# Altium schematic sheet STM32_microcontroller_power.SchDoc: STM32_microcontroller_power
size A4; Date: Not used; ApprovedBy: Not used; CheckedBy: Not used; Author: Not used; CompanyName: STMicroelectronics; DrawnBy: Not used; Engineer: Not used; Organization: Not used; Address1: Not used; Address2: Not used; Address3: Not used; Address4: Not used; DocumentNumber: Not used; Revision: Not used; SheetNumber: 4; SheetTotal: 12; CurrentTime: Not used; CurrentDate: Not used; Time: Not used; DocumentFullPathAndName: Not used; DocumentName: Not used; ModifiedDate: Not used; ImagePath: Not used; ProjectName: Not used; Application_BuildNumber: Not used
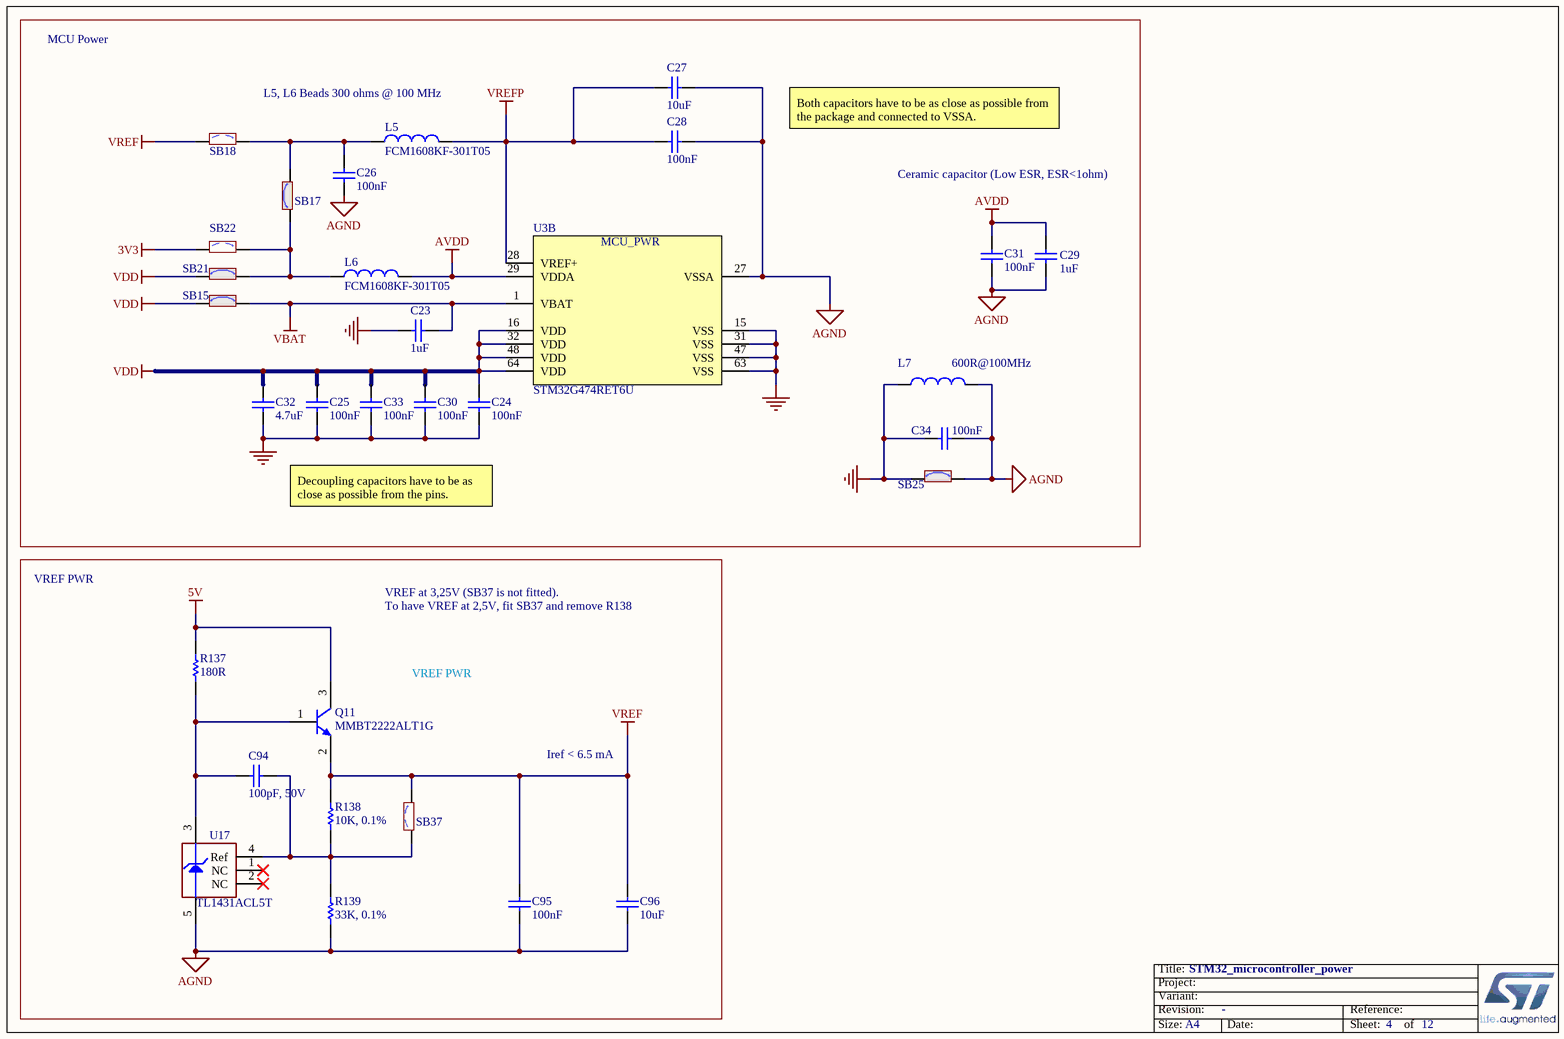
[diagram p0: STM32_microcontroller_power.SchDoc]

## Parts
C23  value 1uF  [C0603]
C24  value 100nF  [C0402]
C25  value 100nF  [C0402]
C26  value 100nF  [C0402]
C27  value 10uF  [C0603]
C28  value 100nF  [C0402]
C29  value 1uF  [C0603]
C30  value 100nF  [C0402]
C31  value 100nF  [C0402]
C32  value 4.7uF  [C0603]
C33  value 100nF  [C0402]
C34  value 100nF  [C0402]
C94  value 100pF, 50V  [C0603_H0P8]
C95  value 100nF  [C0603]
C96  value 10uF  [C0603]
L5  value FCM1608KF-301T05  [L0603]  (hidden comment: BEAD)
L6  value FCM1608KF-301T05  [L0603]  (hidden comment: BEAD)
L7  value 600R@100MHz  [L0603]
Q11  value MMBT2222ALT1G  [NPN_SOT23]  (hidden comment: 9013-SOT23)
R137  value 180R  [R0603]
R138  value 10K, 0.1%  [R0603]
R139  value 33K, 0.1%  [R0603]
SB15  (no value)  [SOLDER-BRIDGE_R0603-0R]
SB17  (no value)  [SOLDER-BRIDGE_R0603-0R]
SB18  (no value)  [SOLDER-BRIDGE_R0603-0R]
SB21  (no value)  [SOLDER-BRIDGE_R0603-0R]
SB22  (no value)  [SOLDER-BRIDGE_R0603-0R]
SB25  (no value)  [SOLDER-BRIDGE_R0603-0R]
SB37  (no value)  [SOLDER-BRIDGE_R0603-0R]
U3  STM32G474RET6U  [ICC_LQFP64_10X10_P050]  (part B of 2)
U17  value TL1431ACL5T  [ICC_SOT23-5L_H1P45]

## Nets
3V3: SB22.1
5V: Q11.3(C) R137.2
AGND: C26.1 C27.1 C28.2 C29.1 C31.1 C34.2 C95.1 C96.1 L7.2 R139.1 SB25.2 U3.27(VSSA) U17.5(Anode)
AVDD: C29.2 C31.2 L6.2 U3.29(VDDA)
GND: C23.1 C24.1 C25.1 C30.1 C32.1 C33.1 C34.1 L7.1 SB25.1 U3.15(VSS) U3.31(VSS) U3.47(VSS) U3.63(VSS)
VBAT: C23.2 SB15.2 U3.1(VBAT)
VDD: C24.2 C25.2 C30.2 C32.2 C33.2 SB15.1 SB21.1 U3.16(VDD) U3.32(VDD) U3.48(VDD) U3.64(VDD)
VREF: C95.2 C96.2 Q11.2(E) R138.2 SB18.1 SB37.2
VREFP: C27.2 C28.1 L5.2 U3.28(VREF+)
NetC26_2: C26.2 L5.1 SB17.2 SB18.2
NetC94_1: C94.1 Q11.1(B) R137.1 U17.3(Cathode)
NetC94_2: C94.2 R138.1 R139.2 SB37.1 U17.4(Ref)
NetL6_1: L6.1 SB17.1 SB21.2 SB22.2

Not connected (* = marked no-connect by the designer): U17 1(NC)* 2(NC)*

## Notes on the sheet
- MCU Power
- L5, L6 Beads 300 ohms @ 100 MHz
- Both capacitors have to be as close as possible from the package and connected to VSSA.
- Ceramic capacitor (Low ESR, ESR<1ohm)
- Decoupling capacitors have to be as close as possible from the pins.
- VREF PWR
- VREF at 3,25V (SB37 is not fitted).
- To have VREF at 2,5V, fit SB37 and remove R138
- Iref < 6.5 mA
- Title:
- Project:
- Size:
- Revision:
- Variant:
- A4
- -
- Date:
- Reference:
- Sheet:
- of
- (in symbol MCD-01584, part B) MCU_PWR

## Library data of the parts
C23 C29 = MCD-00010: Capacitor, MLCC, 1uF, 16V, X5R, 10%, 0603, T=0,8mm; Manufacturer_Part_Number: CC0603KRX5R7BB105; Manufacturer: YAGEO; Provided_By: SUBCO; Internal_Part_Number: MCD-00010; Status: Released; Package: C0603; ComponentLink1Description: Datasheet; Part_Type: Capacitor; ComponentLink1URL: http://tunmcdsvn.tun.st.com/Component_Datasheet_Library/Trunk/Capacitors/Yageo_Multilayer_capacitor_X5R_series_100pF_to_100uF
C24-C26 C28 C30 C31 C33 C34 = MCD-00102: Capacitor, MLCC, 100nF, 16V, X7R, 10%, 0402, T=0,5mm; Manufacturer_Part_Number: CC0402KRX7R7BB104; Manufacturer: YAGEO; Alternate_Manufacturer_Part_Number: GCM155R71C104KA55D; Alternate_Manufacturer: MURATA; Provided_By: SUBCO; Internal_Part_Number: MCD-00102; Status: Released; Package: C0402; ComponentLink1Description: Datasheet; Part_Type: Capacitor; ComponentLink1URL: http://tunmcdsvn.tun.st.com/Component_Datasheet_Library/Trunk/Capacitors/Yageo_Multilayer_Capacitor_X7R_series_100pF_to_22uF
C27 C96 = MCD-01124: Capacitor, MLCC, 10µF, 10V, X5R, 10%, 0603, T=0.8mm; Manufacturer_Part_Number: GRM188R61A106KAAL; Manufacturer: MURATA; Provided_By: SUBCO; Internal_Part_Number: MCD-01124; Status: Released; Part_Type: Capacitor; Package: C0603; ComponentLink1Description: Datasheet; ComponentLink1URL: http://tunmcdsvn.tun.st.com/Component_Datasheet_Library/Trunk/Capacitors/Murata_Capacitor_GR_series
C32 = MCD-00009: Capacitor, MLCC, 4.7uF, 16V, X5R, 10%, 0603, T=0.8mm; Manufacturer_Part_Number: CC0603KRX5R7BB475; Manufacturer: YAGEO; Provided_By: SUBCO; Internal_Part_Number: MCD-00009; ComponentLink1Description: Datasheet; Status: Released; Part_Type: Capacitor; Package: C0603; ComponentLink1URL: http://tunmcdsvn.tun.st.com/Component_Datasheet_Library/Trunk/Capacitors/Yageo_Multilayer_capacitor_X5R_series_100pF_to_100uF
C94 = MCD-01648: Capacitor, MLCC, 100pF, 50V, NPO, 5%, 0603, T=0,8mm; Manufacturer_Part_Number: CC0603JRNPO9BN101; Manufacturer: YAGEO; Provided_By: SUBCO; Internal_Part_Number: MCD-01648; Status: Footprint available; Part_Type: Capacitor; Package: C0603; ComponentLink1Description: Datasheet; ComponentLink1URL: http://tunmcdsvn.tun.st.com/Component_Datasheet_Library/Trunk/Capacitors/Yageo_UPY-GP_NP0_16V-to-50V/YAGEO_NP0_UPY-GP_NP0_16V-to-50V_16.pdf
C95 = MCD-00211: Capacitor, MLCC, 100nF, 16V, X7R, 10%, 0603, T=0,8mm; Manufacturer_Part_Number: CC0603KRX7R7BB104; Manufacturer: YAGEO; Provided_By: SUBCO; Internal_Part_Number: MCD-00211; Status: Released; Part_Type: Capacitor; Package: C0603; ComponentLink1Description: Datasheet; ComponentLink1URL: http://tunmcdsvn.tun.st.com/Component_Datasheet_Library/Trunk/Capacitors/Yageo_Multilayer_Capacitor_X7R_series_100pF_to_22uF
L5 L6 = MCD-01735: Bead,300R,500mA,0603; Part_Type: Inductor; Manufacturer: TAI-TECH; Provided_By: SUBCO; Internal_Part_Number: MCD-01735; Status: Footprint available; Manufacturer_Part_Number: FCM1608KF-301T05; Package: L0603; ComponentLink1Description: Datasheet; ComponentLink1URL: http://tunmcdsvn.tun.st.com/Component_Datasheet_Library/Trunk/Inductors/TaiTech_Bead_FCM1608_series
L7 = MCD-00047: SMD Chip ferrite bead, 600R@100MHz +/-25%, 350mA, 500mohm DC, 0603, T=0.8mm; Part_Type: Inductor; Manufacturer_Part_Number: FCM1608KF-601T03; Manufacturer: TAI-TECH; Provided_By: SUBCO; Internal_Part_Number: MCD-00047; Status: Released; ComponentLink1Description: Datasheet; ComponentLink1URL: http://tunmcdsvn.tun.st.com/Component_Datasheet_Library/Trunk/Inductors/TaiTech_Bead_FCM1608_series
Q11 = MCD-01737: NPN Bipolar Transistor; Part_Type: IC; Manufacturer: ON SEMICONDUCTOR; Provided_By: SUBCO; Revision: *; Internal_Part_Number: MCD-01737; Status: Footprint available; Manufacturer_Part_Number: MMBT2222ALT1G; ComponentLink1Description: Datasheet; ComponentLink1URL: http://tunmcdsvn.tun.st.com/Component_Datasheet_Library/Trunk/IC/ON_SEMICONDUCTOR_Transistor_MMBT2222ALT1G/ON_SEMICONDUCTOR_Transistor_MMBT2222ALT1G.pdf
R137 = MCD-00342: Resistor,180R,0603,1%,1/10W; Manufacturer_Part_Number: RC0603FR-07180RL; Manufacturer: YAGEO; Provided_By: SUBCO; Internal_Part_Number: MCD-00342; Status: Released; Part_Type: Resistor; Package: R0603; ComponentLink1Description: Datasheet; ComponentLink1URL: http://tunmcdsvn.tun.st.com/Component_Datasheet_Library/Trunk/Resistors/Yageo_Resistor_RC0603-series
R138 = MCD-01669: Resistor, 10K, 0603, 0.1%,1/10W; Manufacturer_Part_Number: ERA3AEB103V; Manufacturer: PANASONIC; Provided_By: SUBCO; Internal_Part_Number: MCD-01669; Status: Footprint available; Part_Type: Resistor; Package: R0603; ComponentLink1Description: Datasheet; ComponentLink1URL: http://tunmcdsvn.tun.st.com/Component_Datasheet_Library/Trunk/Resistors/PANASONIC_Resistor_ERA-Series_HighReliability/PANASONIC_Resistor_ERA-Series_HighReliability.pdf
R139 = MCD-01670: Resistor, 33K, 0603, 0.1%,1/10W; Manufacturer_Part_Number: ERA3AEB333V; Manufacturer: PANASONIC; Provided_By: SUBCO; Internal_Part_Number: MCD-01670; Status: Footprint available; Part_Type: Resistor; Package: R0603; ComponentLink1Description: Datasheet; ComponentLink1URL: http://tunmcdsvn.tun.st.com/Component_Datasheet_Library/Trunk/Resistors/PANASONIC_Resistor_ERA-Series_HighReliability/PANASONIC_Resistor_ERA-Series_HighReliability.pdf
SB15 SB17 SB21 SB25 = MCD-00071: Solder Bridge ON; Part_Type: Mechanical; Manufacturer_Part_Number: RC0603JR-070RL; Manufacturer: YAGEO; Provided_By: SUBCO; Internal_Part_Number: MCD-00071; Status: Released; Package: SB0603; ComponentLink1Description: Datasheet; ComponentLink1URL: http://tunmcdsvn.tun.st.com/Component_Datasheet_Library/Trunk/Resistors/Yageo_Resistor_RC0603-series
SB18 SB22 SB37 = MCD-00072: Solder Bridge OFF; Part_Type: Mechanical; Manufacturer_Part_Number: RC0603JR-070RL; Manufacturer: YAGEO; Provided_By: SUBCO; Internal_Part_Number: MCD-00072; Status: Released; Package: SB0603; ComponentLink1Description: Datasheet; ComponentLink1URL: http://tunmcdsvn.tun.st.com/Component_Datasheet_Library/Trunk/Resistors/Yageo_Resistor_RC0603-series
U3 = MCD-01584: STM32G474RET6U MCU, LQFP64 10x10, 1.6, 512KB Flash, 128KB SRAM; Part_Type: IC; Manufacturer: STMICROELECTRONICS; ECCN_US: 3A991A2; ECCN_EU: NEC; Provided_By: SUBCO with ST control; Internal_Part_Number: MCD-01584; Value: STM32G474RET6U; Status: Checked; Manufacturer_Part_Number: STM32G474RET6U; Package: LQFP64 10x10 x 1.6; ComponentLink1Description: Datasheet; ComponentLink1URL: http://tunmcdsvn.tun.st.com/Component_Datasheet_Library/Trunk/IC/STM_MCU_STM32G474RET6U/STM_MCU_STM32G474RET6U.pdf
U17 = MCD-01157: Programmable voltage reference; Part_Type: IC; Manufacturer: STMICROELECTRONICS; Provided_By: SUBCO with ST control; Internal_Part_Number: MCD-01157; Status: Checked; Manufacturer_Part_Number: TL1431ACL5T; Package: SOT23-5L; ComponentLink1Description: Datasheet; ComponentLink1URL: http://tunmcdsvn.tun.st.com/Component_Datasheet_Library/Trunk/IC/STM_voltage_reference_TL1431ACL5T/